# Altium schematic sheet SH6 - SCIENCE CONTROLS.SchDoc: Science Controls
size B; CheckedBy: Lance Bantoto; Engineer: Christopher Arjune; Organization: UW Robotics; Address1: 200 University Avenue; Address2: Waterloo; Address3: Ontario; Address4: Canada N2L 3G6; Revision: 1; SheetNumber: 6; SheetTotal: 6
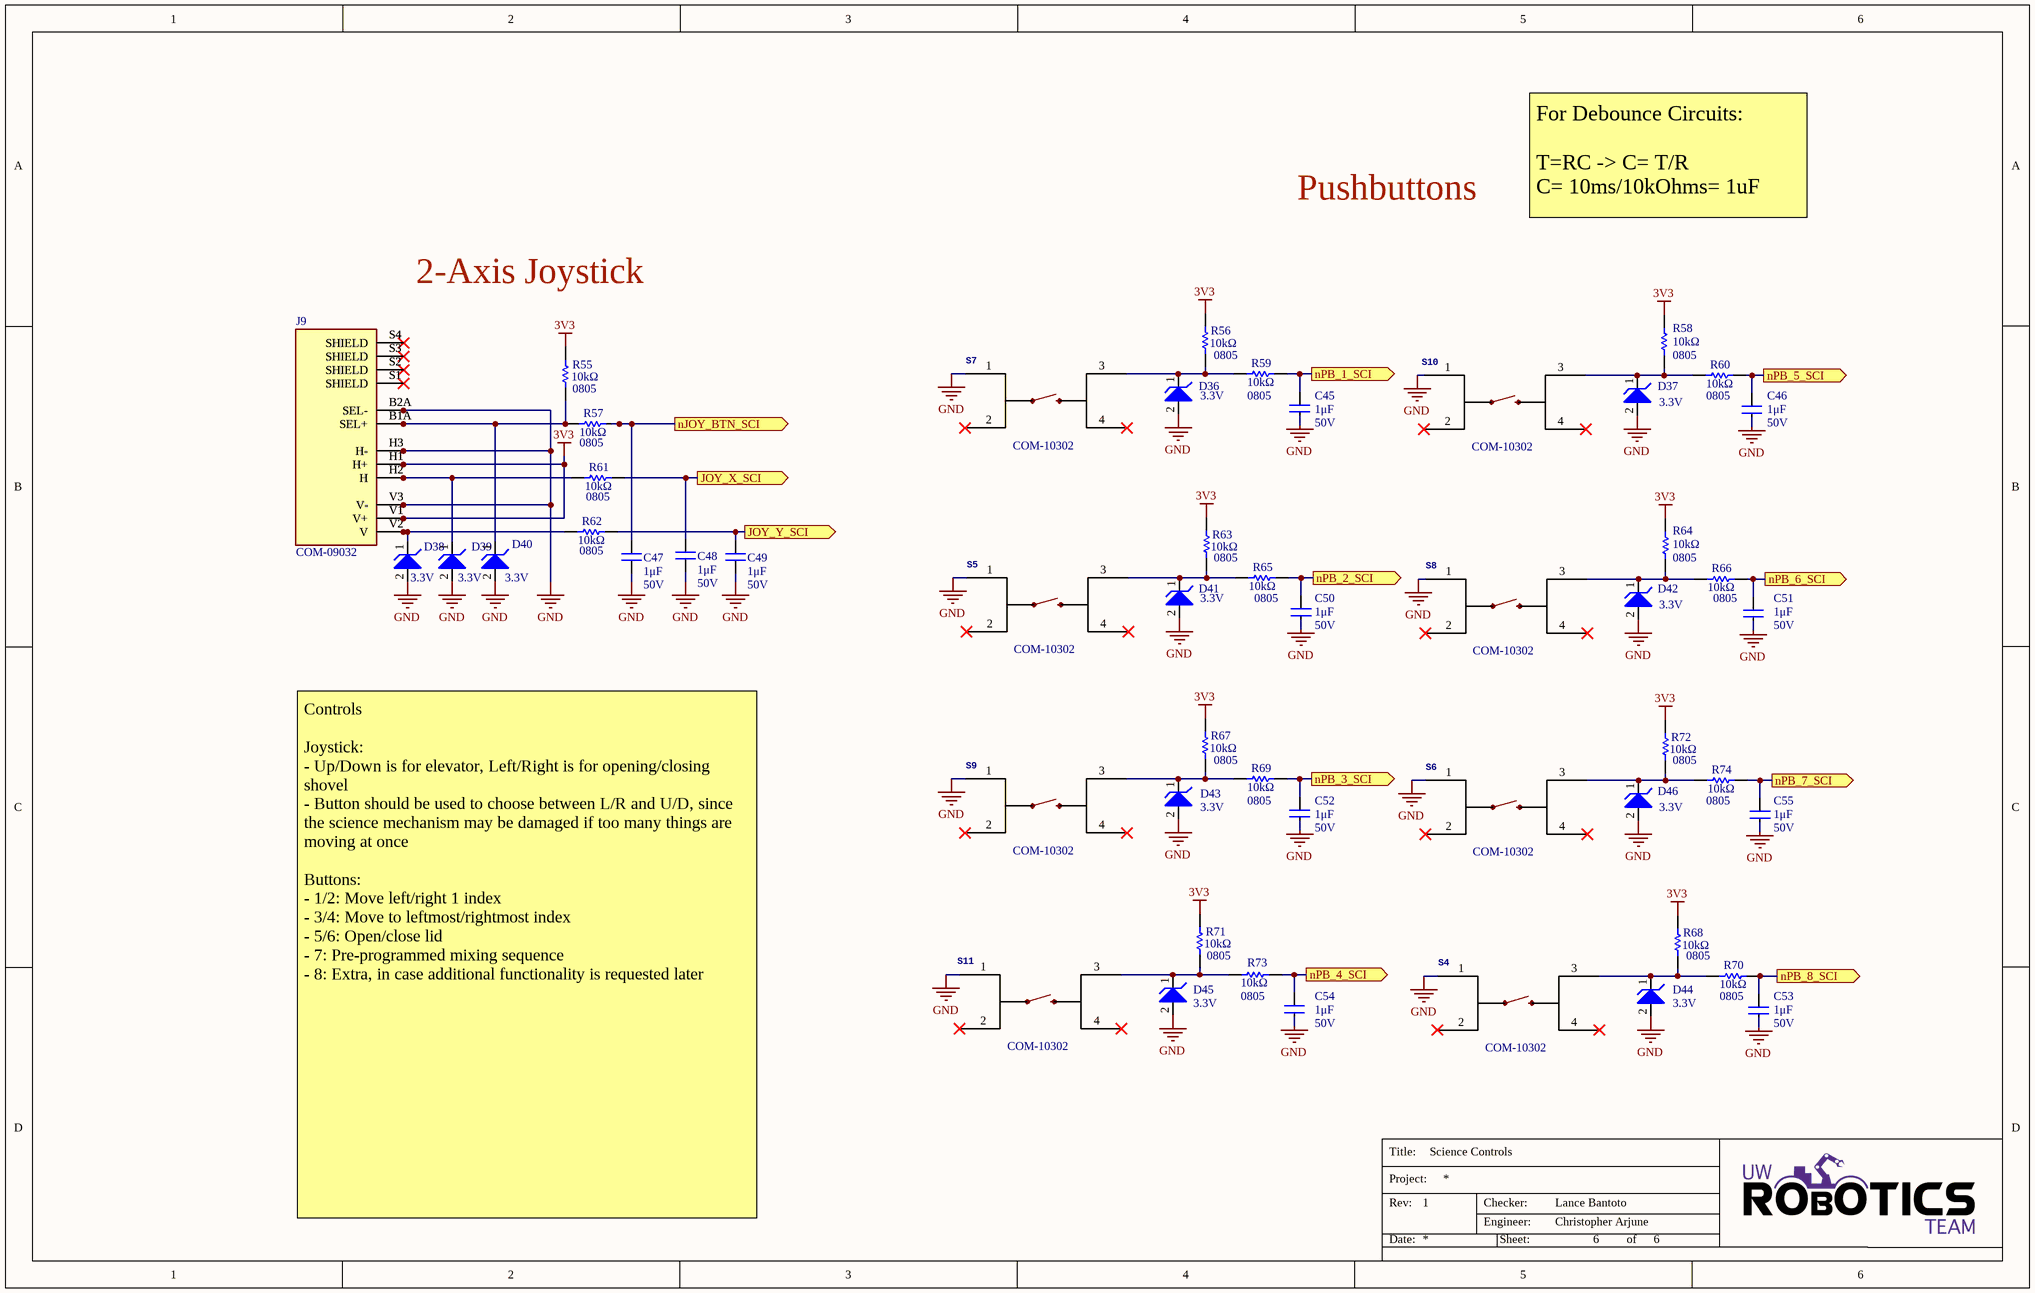
[diagram p0: SH6 - SCIENCE CONTROLS.SchDoc]

## Parts
C45  value 1μF  Voltage Rating: 50V  [CAP2012]  (hidden comment: CAP_1uF_50V_0805)
C46  value 1μF  Voltage Rating: 50V  [CAP2012]  (hidden comment: CAP_1uF_50V_0805)
C47  value 1μF  Voltage Rating: 50V  [CAP2012]  (hidden comment: CAP_1uF_50V_0805)
C48  value 1μF  Voltage Rating: 50V  [CAP2012]  (hidden comment: CAP_1uF_50V_0805)
C49  value 1μF  Voltage Rating: 50V  [CAP2012]  (hidden comment: CAP_1uF_50V_0805)
C50  value 1μF  Voltage Rating: 50V  [CAP2012]  (hidden comment: CAP_1uF_50V_0805)
C51  value 1μF  Voltage Rating: 50V  [CAP2012]  (hidden comment: CAP_1uF_50V_0805)
C52  value 1μF  Voltage Rating: 50V  [CAP2012]  (hidden comment: CAP_1uF_50V_0805)
C53  value 1μF  Voltage Rating: 50V  [CAP2012]  (hidden comment: CAP_1uF_50V_0805)
C54  value 1μF  Voltage Rating: 50V  [CAP2012]  (hidden comment: CAP_1uF_50V_0805)
C55  value 1μF  Voltage Rating: 50V  [CAP2012]  (hidden comment: CAP_1uF_50V_0805)
D36  Voltage - Reverse Standoff (Typ): 3.3V  (hidden comment: TVS_DIODE_UNIDIR_3.3V)
D37  Voltage - Reverse Standoff (Typ): 3.3V  (hidden comment: TVS_DIODE_UNIDIR_3.3V)
D38  Voltage - Reverse Standoff (Typ): 3.3V  (hidden comment: TVS_DIODE_UNIDIR_3.3V)
D39  Voltage - Reverse Standoff (Typ): 3.3V  (hidden comment: TVS_DIODE_UNIDIR_3.3V)
D40  Voltage - Reverse Standoff (Typ): 3.3V  (hidden comment: TVS_DIODE_UNIDIR_3.3V)
D41  Voltage - Reverse Standoff (Typ): 3.3V  (hidden comment: TVS_DIODE_UNIDIR_3.3V)
D42  Voltage - Reverse Standoff (Typ): 3.3V  (hidden comment: TVS_DIODE_UNIDIR_3.3V)
D43  Voltage - Reverse Standoff (Typ): 3.3V  (hidden comment: TVS_DIODE_UNIDIR_3.3V)
D44  Voltage - Reverse Standoff (Typ): 3.3V  (hidden comment: TVS_DIODE_UNIDIR_3.3V)
D45  Voltage - Reverse Standoff (Typ): 3.3V  (hidden comment: TVS_DIODE_UNIDIR_3.3V)
D46  Voltage - Reverse Standoff (Typ): 3.3V  (hidden comment: TVS_DIODE_UNIDIR_3.3V)
J9  Manufacturer Part Number 1: COM-09032  [2_AXIS_JOYSTICK]  (hidden comment: 2_AXIS_JOYSTICK)
R55  value 10kΩ  Package/Footprint: 0805  [RESC0805]  (hidden comment: RES_10kΩ_0805_5%)
R56  value 10kΩ  Package/Footprint: 0805  [RESC0805]  (hidden comment: RES_10kΩ_0805_5%)
R57  value 10kΩ  Package/Footprint: 0805  [RESC0805]  (hidden comment: RES_10kΩ_0805_5%)
R58  value 10kΩ  Package/Footprint: 0805  [RESC0805]  (hidden comment: RES_10kΩ_0805_5%)
R59  value 10kΩ  Package/Footprint: 0805  [RESC0805]  (hidden comment: RES_10kΩ_0805_5%)
R60  value 10kΩ  Package/Footprint: 0805  [RESC0805]  (hidden comment: RES_10kΩ_0805_5%)
R61  value 10kΩ  Package/Footprint: 0805  [RESC0805]  (hidden comment: RES_10kΩ_0805_5%)
R62  value 10kΩ  Package/Footprint: 0805  [RESC0805]  (hidden comment: RES_10kΩ_0805_5%)
R63  value 10kΩ  Package/Footprint: 0805  [RESC0805]  (hidden comment: RES_10kΩ_0805_5%)
R64  value 10kΩ  Package/Footprint: 0805  [RESC0805]  (hidden comment: RES_10kΩ_0805_5%)
R65  value 10kΩ  Package/Footprint: 0805  [RESC0805]  (hidden comment: RES_10kΩ_0805_5%)
R66  value 10kΩ  Package/Footprint: 0805  [RESC0805]  (hidden comment: RES_10kΩ_0805_5%)
R67  value 10kΩ  Package/Footprint: 0805  [RESC0805]  (hidden comment: RES_10kΩ_0805_5%)
R68  value 10kΩ  Package/Footprint: 0805  [RESC0805]  (hidden comment: RES_10kΩ_0805_5%)
R69  value 10kΩ  Package/Footprint: 0805  [RESC0805]  (hidden comment: RES_10kΩ_0805_5%)
R70  value 10kΩ  Package/Footprint: 0805  [RESC0805]  (hidden comment: RES_10kΩ_0805_5%)
R71  value 10kΩ  Package/Footprint: 0805  [RESC0805]  (hidden comment: RES_10kΩ_0805_5%)
R72  value 10kΩ  Package/Footprint: 0805  [RESC0805]  (hidden comment: RES_10kΩ_0805_5%)
R73  value 10kΩ  Package/Footprint: 0805  [RESC0805]  (hidden comment: RES_10kΩ_0805_5%)
R74  value 10kΩ  Package/Footprint: 0805  [RESC0805]  (hidden comment: RES_10kΩ_0805_5%)
S4  Manufacturer Part Number 1: COM-10302  [TACTILE_SWITCH_PTH_12MM]  (hidden comment: SW_MOMENTARY_PUSHBUTTON)
S5  Manufacturer Part Number 1: COM-10302  [TACTILE_SWITCH_PTH_12MM]  (hidden comment: SW_MOMENTARY_PUSHBUTTON)
S6  Manufacturer Part Number 1: COM-10302  [TACTILE_SWITCH_PTH_12MM]  (hidden comment: SW_MOMENTARY_PUSHBUTTON)
S7  Manufacturer Part Number 1: COM-10302  [TACTILE_SWITCH_PTH_12MM]  (hidden comment: SW_MOMENTARY_PUSHBUTTON)
S8  Manufacturer Part Number 1: COM-10302  [TACTILE_SWITCH_PTH_12MM]  (hidden comment: SW_MOMENTARY_PUSHBUTTON)
S9  Manufacturer Part Number 1: COM-10302  [TACTILE_SWITCH_PTH_12MM]  (hidden comment: SW_MOMENTARY_PUSHBUTTON)
S10  Manufacturer Part Number 1: COM-10302  [TACTILE_SWITCH_PTH_12MM]  (hidden comment: SW_MOMENTARY_PUSHBUTTON)
S11  Manufacturer Part Number 1: COM-10302  [TACTILE_SWITCH_PTH_12MM]  (hidden comment: SW_MOMENTARY_PUSHBUTTON)

## Ports
JOY_X_SCI (out), JOY_Y_SCI (out), nJOY_BTN_SCI (out), nPB_1_SCI (out), nPB_2_SCI (out), nPB_3_SCI (out), nPB_4_SCI (out), nPB_5_SCI (out), nPB_6_SCI (out), nPB_7_SCI (out), nPB_8_SCI (out)

## Nets
3V3: J9.H1(H+) J9.V1(V+) R55.1 R56.1 R58.1 R63.1 R64.1 R67.1 R68.1 R71.1 R72.1
GND: C45.1 C46.1 C47.1 C48.1 C49.1 C50.1 C51.1 C52.1 C53.1 C54.1 C55.1 D36.2 D37.2 D38.2 D39.2 D40.2 D41.2 D42.2 D43.2 D44.2 D45.2 D46.2 J9.B2A(SEL-) J9.H3(H-) J9.V3(V-) S4.1 S5.1 S6.1 S7.1 S8.1 S9.1 S10.1 S11.1
JOY_X_SCI: C48.2 R61.2 ; port JOY_X_SCI
JOY_Y_SCI: C49.2 R62.2 ; port JOY_Y_SCI
nJOY_BTN_SCI: C47.2 R57.2 ; port nJOY_BTN_SCI
nPB_1_SCI: C45.2 R59.2 ; port nPB_1_SCI
nPB_2_SCI: C50.2 R65.2 ; port nPB_2_SCI
nPB_3_SCI: C52.2 R69.2 ; port nPB_3_SCI
nPB_4_SCI: C54.2 R73.2 ; port nPB_4_SCI
nPB_5_SCI: C46.2 R60.2 ; port nPB_5_SCI
nPB_6_SCI: C51.2 R66.2 ; port nPB_6_SCI
nPB_7_SCI: C55.2 R74.2 ; port nPB_7_SCI
nPB_8_SCI: C53.2 R70.2 ; port nPB_8_SCI
NetD36_1: D36.1 R56.2 R59.1 S7.3
NetD37_1: D37.1 R58.2 R60.1 S10.3
NetD38_1: D38.1 J9.V2(V) R62.1
NetD39_1: D39.1 J9.H2(H) R61.1
NetD40_1: D40.1 J9.B1A(SEL+) R55.2 R57.1
NetD41_1: D41.1 R63.2 R65.1 S5.3
NetD42_1: D42.1 R64.2 R66.1 S8.3
NetD43_1: D43.1 R67.2 R69.1 S9.3
NetD44_1: D44.1 R68.2 R70.1 S4.3
NetD45_1: D45.1 R71.2 R73.1 S11.3
NetD46_1: D46.1 R72.2 R74.1 S6.3

Not connected (* = marked no-connect by the designer): J9 S1(SHIELD)* S2(SHIELD)* S3(SHIELD)* S4(SHIELD)*; S4 2* 4*; S5 2* 4*; S6 2* 4*; S7 2* 4*; S8 2* 4*; S9 2* 4*; S10 2* 4*; S11 2* 4*

## Notes on the sheet
- Pushbuttons
- For Debounce Circuits:
  T=RC -> C= T/R
  C= 10ms/10kOhms= 1uF
- 2-Axis Joystick
- Controls
  Joystick:
  - Up/Down is for elevator, Left/Right is for opening/closing shovel
  - Button should be used to choose between L/R and U/D, since the science mechanism may be damaged if too many things are moving at once
  Buttons:
  - 1/2: Move left/right 1 index
  - 3/4: Move to leftmost/rightmost index
  - 5/6: Open/close lid
  - 7: Pre-programmed mixing sequence
  - 8: Extra, in case additional functionality is requested later
- Title:
- Project:
- Date:
- Rev:
- Checker:
- Engineer:
- Sheet:
- of

## Library data of the parts
C45-C55 = CAP_1uF_50V_0805: CAP CER 1UF 50V X7R 0805; Manufacturer 1: Samsung Electro-Mechanics; Manufacturer Part Number 1: CL21B105KBFNNNG; Package/Footprint: 0805; Supplier 1: Digi-Key; Supplier Part Number 1: 1276-6470-1-ND; Mounting Type: SMD; LCSC Part #: C28323
D36-D46 = TVS_DIODE_UNIDIR_3.3V: TVS DIODE 3.3V 14.1V SOD523; Manufacturer 1: ON Semiconductor; Manufacturer Part Number 1: ESD5Z3.3T1G; Package/Footprint: SOD-523; Voltage - Breakdown (Min): 5V; Supplier 1: Digi-Key; Supplier Part Number 1: ESD5Z3.3T1GOSCT-ND; Mounting Type: SMD; LCSC Part #: C61148; Voltage - Clamping (Max) @ Ipp: 14.1V
J9 = 2_AXIS_JOYSTICK: JOYSTICK 10K OHM 2 AXIS TH; Manufacturer 1: SparkFun; Supplier 1: Digi-Key; Supplier Part Number 1: 1568-1526-ND; Verified: No; Mounting Type: TH; Package/Footprint: TH; LCSC Part #: *
R55-R74 = RES_10kΩ_0805_5%: RES 10K OHM 5% 1/8W 0805; Manufacturer 1: Panasonic Electronic Components; Manufacturer Part Number 1: ERJ-6GEYJ103V; Supplier 1: Digi-Key; Supplier Part Number 1: P10KACT-ND; LCSC Part #: C17414; Mounting Type: SMD
S4-S11 = SW_MOMENTARY_PUSHBUTTON: TACTILE MOMENTARY PUSHBUTTON SPST; Manufacturer 1: SparkFun; Package/Footprint: TH; Supplier 1: Digi-Key; Supplier Part Number 1: 1568-1332-ND; Mounting Type: TH; Verified: No